# Altium schematic sheet Sheet_MAGJACK.SchDoc
size A4
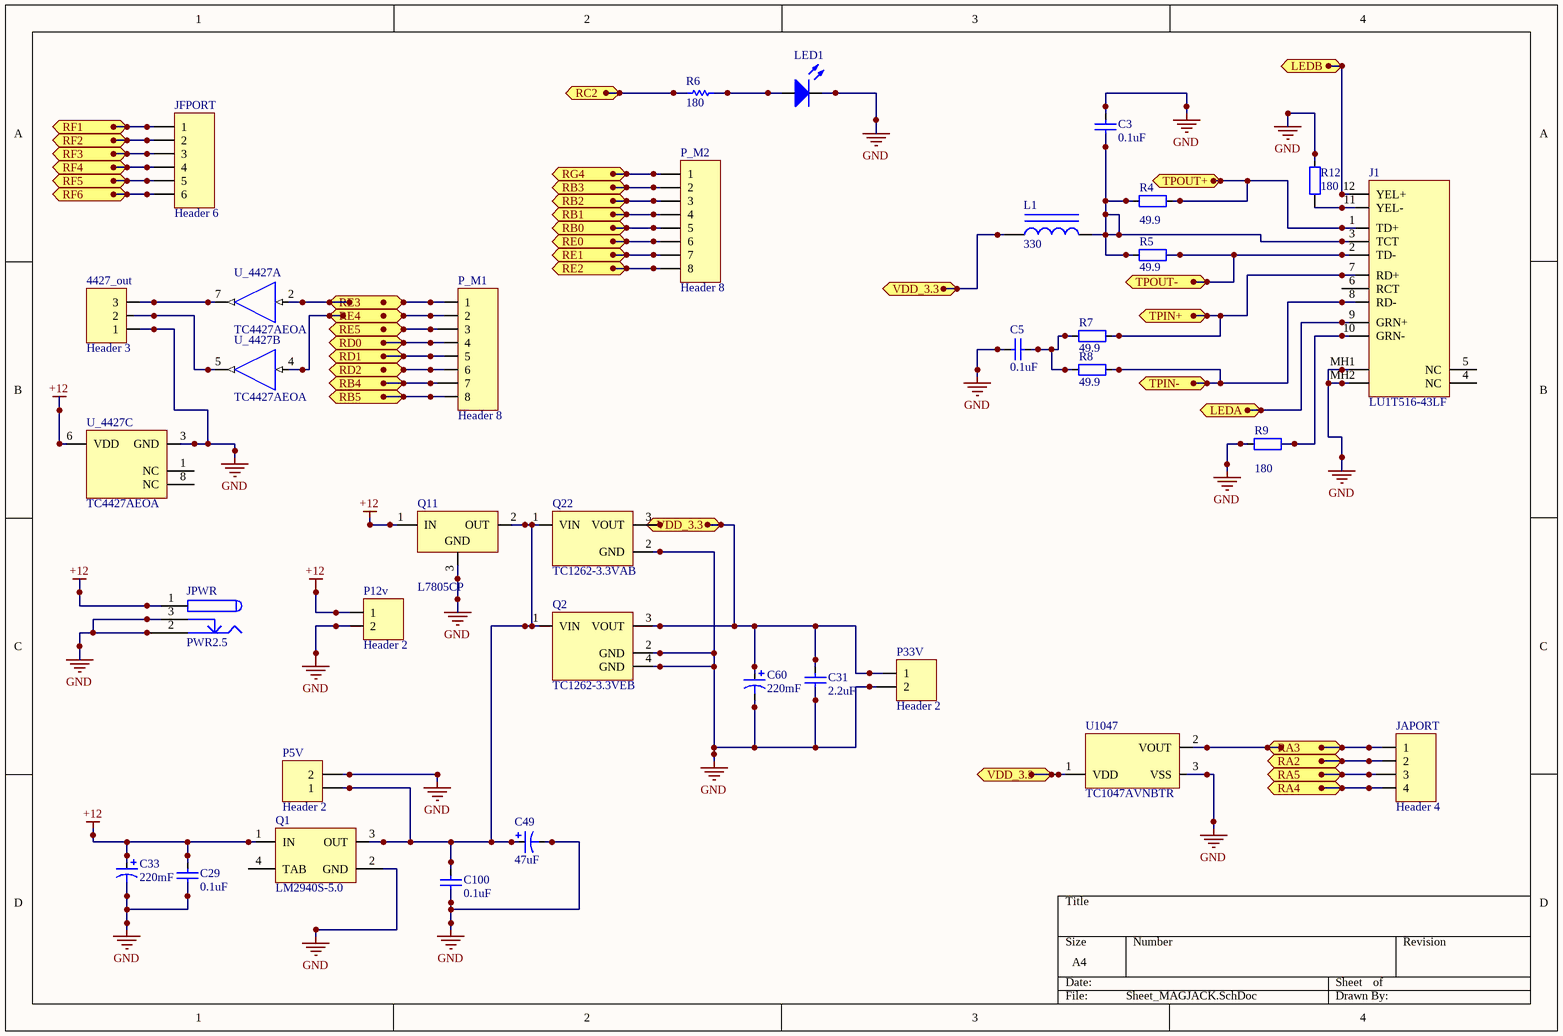
[diagram p0: Sheet_MAGJACK.SchDoc]

## Parts
4427_out  Header 3  [BIG4]
C3  0.1uF  [CAPC2012L]
C5  0.1uF  [CAPC2012L]
C29  0.1uF  [CAPC2012L]
C31  2.2uF  [CAPC3216L]
C33  220mF  [CAPPR5-10x12.5]
C49  47uF  [NSOALUMB]
C60  220mF  [CAPPR5-10x12.5]
C100  0.1uF  [CAPC2012L]
J1  LU1T516-43LF  [CON_RJ45_RA_LEDS]
JAPORT  Header 4  [HDR1X4]
JFPORT  Header 6  [HDR1X6]
JPWR  PWR2.5  [KLD-0202]
L1  330  [RESC2012L]
LED1  LED2  [CAPC2012L]  (value not drawn)
P5V  Header 2  [HDR1X2]
P12v  Header 2  [HDR1X2]
P33V  Header 2  [HDR1X2]
P_M1  Header 8  [HDR1X8]
P_M2  Header 8  [HDR1X8]
Q1  LM2940S-5.0  [TS3B_N]
Q2  TC1262-3.3VEB  [DDPAK-EB3_N]
Q11  L7805CP  [ISOWATT220AB]
Q22  TC1262-3.3VAB  [TO-220-AB3]
R4  49.9  [RESC2012L]
R5  49.9  [RESC2012L]
R6  180  [RESC2012L]
R7  49.9  [RESC2012L]
R8  49.9  [RESC2012L]
R9  180  [RESC2012L]
R12  180  [RESC2012L]
U1047  TC1047AVNBTR  [SOT-23-NB3_N]
U_4427  TC4427AEOA  [SOIC-OA8_N]  (parts A,B,C of 3)

## Ports
LEDA, LEDB, RA2, RA3, RA4, RA5, RB0, RB1, RB2, RB3, RB4, RB5, RC2, RD0, RD1, RD2, RE0, RE1, RE2, RE3, RE4, RE5, RF1, RF2, RF3, RF4, RF5, RF6, RG4, TPIN+, TPIN-, TPOUT+, TPOUT-, VDD_3.3

## Nets
+12: C29.2 C33.1 JPWR.1 JPWR.1A JPWR.1B P12v.1 Q1.1(IN) Q11.1(IN) U_4427.6(VDD)
GND: 4427_out.1 C3.2 C5.1 C29.1 C31.1 C33.2 C49.2 C60.2 C100.1 J1.MH1 J1.MH2 JPWR.2 JPWR.2A JPWR.2B JPWR.3 JPWR.3A JPWR.3B LED1.2(K) P5V.2 P12v.2 P33V.2 Q1.2(GND) Q2.2(GND) Q2.4(GND) Q11.3(GND) Q22.2(GND) R9.1 R12.2 U1047.3(VSS) U_4427.3(GND)
LEDA: J1.9(GRN+) ; port LEDA
LEDB: J1.12(YEL+) ; port LEDB
RA2: JAPORT.2 ; port RA2
RA3: JAPORT.1 U1047.2(VOUT) ; port RA3
RA4: JAPORT.4 ; port RA4
RA5: JAPORT.3 ; port RA5
RB0: P_M2.5 ; port RB0
RB1: P_M2.4 ; port RB1
RB2: P_M2.3 ; port RB2
RB3: P_M2.2 ; port RB3
RB4: P_M1.7 ; port RB4
RB5: P_M1.8 ; port RB5
RC2: R6.1 ; port RC2
RD0: P_M1.4 ; port RD0
RD1: P_M1.5 ; port RD1
RD2: P_M1.6 ; port RD2
RE0: P_M2.6 ; port RE0
RE1: P_M2.7 ; port RE1
RE2: P_M2.8 ; port RE2
RE3: P_M1.1 U_4427.2(INA) ; port RE3
RE4: P_M1.2 U_4427.4(INB) ; port RE4
RE5: P_M1.3 ; port RE5
RF1: JFPORT.1 ; port RF1
RF2: JFPORT.2 ; port RF2
RF3: JFPORT.3 ; port RF3
RF4: JFPORT.4 ; port RF4
RF5: JFPORT.5 ; port RF5
RF6: JFPORT.6 ; port RF6
RG4: P_M2.1 ; port RG4
TPIN+: J1.7(RD+) R7.2 ; port TPIN+
TPIN-: J1.8(RD-) R8.2 ; port TPIN-
TPOUT+: J1.1(TD+) R4.2 ; port TPOUT+
TPOUT-: J1.2(TD-) R5.2 ; port TPOUT-
VDD_3.3: C31.2 C60.1 L1.1 P33V.1 Q2.3(VOUT) U1047.1(VDD) ; port VDD_3.3
Net4427_out_2: 4427_out.2 U_4427.5(OUTB)
Net4427_out_3: 4427_out.3 U_4427.7(OUTA)
NetC3_1: C3.1 J1.3(TCT) L1.2 R4.1 R5.1
NetC5_2: C5.2 R7.1 R8.1
NetC49_1: C49.1 C100.2 P5V.1 Q1.3(OUT) Q2.1(VIN) Q11.2(OUT) Q22.1(VIN)
NetJ1_10: J1.10(GRN-) R9.2
NetJ1_11: J1.11(YEL-) R12.1
NetLED1_1: LED1.1(A) R6.2

Not connected (* = marked no-connect by the designer): J1 4(NC) 5(NC) 6(RCT); Q1 4(TAB); Q22 3(VOUT); U_4427 1(NC) 8(NC)

## Library data of the parts
4427_out = Header 3: Header, 3-Pin; LatestRevisionDate: 17-Jul-2002; LatestRevisionNote: Re-released for DXP Platform.; Publisher: Altium Limited
C3 C5 C29 C31 = Cap: Capacitor; Published: 8-Jun-2000; LatestRevisionDate: 17-Jul-2002; LatestRevisionNote: Re-released for DXP Platform.; PackageReference: RAD-0.3; Publisher: Altium Limited
  C3 C5 C29: Value: 0.1uF
  C31: Value: 2.2uF
C33 C49 C60 = Cap Pol1: Polarized Capacitor (Radial); Published: 8-Jun-2000; LatestRevisionDate: 17-Jul-2002; LatestRevisionNote: Re-released for DXP Platform.; PackageReference: RB7.6-15; Publisher: Altium Limited
  C33 C60: Value: 220mF
  C49: Value: 47uF
C100 = Cap Semi: Capacitor (Semiconductor SIM Model); Published: 8-Jun-2000; LatestRevisionDate: 29-May-2009; LatestRevisionNote: IPC-7351 Footprint Added.; PackageReference: C1206; Publisher: Altium Limited; PackageDescription: Chip Capacitor; Value: 0.1uF
J1 = Component_1
JAPORT = Header 4: Header, 4-Pin; LatestRevisionDate: 17-Jul-2002; LatestRevisionNote: Re-released for DXP Platform.; Publisher: Altium Limited
JFPORT = Header 6: Header, 6-Pin; LatestRevisionDate: 17-Jul-2002; LatestRevisionNote: Re-released for DXP Platform.; Publisher: Altium Limited
JPWR = PWR2.5: DC Power Jack, 2.5mm, KLD Series, PCB Mount; Published: 5-Jan-2004; DatasheetDocument: 09-May-2002; Publisher: Altium Limited
L1 = Inductor Iron: Magnetic-Core Inductor; Published: 24-Mar-1999; LatestRevisionDate: 17-Jul-2002; LatestRevisionNote: Re-released for DXP Platform.; PackageReference: AXIAL-0.9; Publisher: Altium Limited; Value: 330
LED1 = LED2: Typical RED, GREEN, YELLOW, AMBER GaAs LED; Published: 8-Jun-2000; LatestRevisionDate: 17-Jul-2002; LatestRevisionNote: Re-released for DXP Platform.; PackageReference: 3.2X1.6X1.1; Publisher: Altium Limited; PackageVersion: Feb-2002
P5V P12v P33V = Header 2: Header, 2-Pin; LatestRevisionDate: 17-Jul-2002; LatestRevisionNote: Re-released for DXP Platform.; Publisher: Altium Limited
P_M1 P_M2 = Header 8: Header, 8-Pin; LatestRevisionDate: 17-Jul-2002; LatestRevisionNote: Re-released for DXP Platform.; Publisher: Altium Limited
Q1 = LM2940S-5.0: 1A Low Dropout Regulator; Manufacturer: National Semiconductor; CompType: LDO IC; PackageTopMarking: NSUZXYTTE#*LM2940S*-5.0 P+; PowerWise: N; Published: 4-Dec-2008; DatasheetVersion: Jan-2007; PackageVersion: revF, Apr-2005; PackageReference: TS3B; Publisher: Altium Limited; PackageDescription: TO-263, Molded, .400 x .390 x .180in, 3 Lead, .1in Pitch, Surface Mount; PartNumber: LM2940S-5.0; RoHS: O; PinCount: 3; DigiKeyPartNumber: LM2940S-5.0-ND; Code_JEDEC: MO-169-AA; ComponentLink1Description: LM2940 Datasheet; ComponentLink1URL: http://www.national.com/ds/LM/LM2940.pdf; ComponentLink2Description: LM2940 Web Page; ComponentLink2URL: http://www.national.com/pf/LM/LM2940.html; ComponentLink3Description: TS3B Package Page; ComponentLink3URL: http://www.national.com/packaging/folders/ts3b.html
Q2 = TC1262-3.3VEB: 500mA Fixed Output CMOS LDO, 3-Pin DDPAK, Extended Temperature; FirstPublished: 29-Jan-2009; DatasheetVersion: revB, 2002; PackageVersion: revBB, Aug-2009; PackageReference: DDPAK-EB3; Publisher: Altium Limited; PackageDescription: 3-Lead Plastic (EB) [DDPAK]; ComponentLink1Description: Datasheet; ComponentLink1URL: http://ww1.microchip.com/downloads/en/DeviceDoc/21373b.pdf; ComponentLink2Description: Packaging Specification; ComponentLink2URL: http://www.microchip.com/stellent/groups/techpub_sg/documents/packagingspec/en012702.pdf; ComponentLink3Description: Microchip.com Home; ComponentLink3URL: http://www.microchip.com/
Q11 = L7805CP: Positive Voltage Regulator; Note: Tab is connected to pin 3 (GND).; Published: 24-Aug-2001; LatestRevisionDate: 17-Jul-2002; LatestRevisionNote: Re-released for DXP Platform.; DatasheetVersion: Dec-1998; PackageVersion: Jul-1998; PackageReference: ISOWATT220AB; Publisher: Altium Limited; PackageDescription: TO, Thru-Hole, Vertical, Heatsink Mounted; 3 In-Line Leads; Pitch 2.54 mm; Pin sequence 1, 3, 2; ComponentLink1Description: Manufacturer Link; ComponentLink1URL: http://www.st.com/
Q22 = TC1262-3.3VAB: 500mA Fixed Output CMOS LDO, 3-Pin TO-220, Extended Temperature; FirstPublished: 29-Jan-2009; DatasheetVersion: revB, 2002; PackageVersion: revBB, Aug-2009; PackageReference: TO-220-AB3; Publisher: Altium Limited; PackageDescription: 3-Lead Plastic Transistor Outline (AB) [TO-220]; Supplier 1: Digi-Key; Supplier Part Number 1: TC1262-3.3VAB-ND; Supplier 2: Newark; Supplier Part Number 2: 92C5755; ComponentLink1Description: Datasheet; ComponentLink1URL: http://ww1.microchip.com/downloads/en/DeviceDoc/21373b.pdf; ComponentLink2Description: Packaging Specification; ComponentLink2URL: http://www.microchip.com/stellent/groups/techpub_sg/documents/packagingspec/en012702.pdf; ComponentLink3Description: Microchip.com Home; ComponentLink3URL: http://www.microchip.com/
R4 R5 R7-R9 R12 = Res2: Resistor; Published: 8-Jun-2000; LatestRevisionDate: 17-Jul-2002; LatestRevisionNote: Re-released for DXP Platform.; PackageReference: AXIAL-0.4; Publisher: Altium Limited
  R4 R5 R7 R8: Value: 49.9
  R9 R12: Value: 180
R6 = Res Semi: Semiconductor Resistor; Published: 8-Jun-2000; LatestRevisionDate: 17-Jul-2002; LatestRevisionNote: Re-released for DXP Platform.; PackageReference: AXIAL-0.5; Publisher: Altium Limited; Value: 180
U1047 = TC1047AVNBTR: Precision Temperature-to-Voltage Converter, 3-Pin SOT-23, Extended Temperature, Tape and Reel; FirstPublished: 29-Jan-2009; DatasheetVersion: revC, May-2005; PackageVersion: revBB, Aug-2009; PackageReference: SOT-23-NB3; Publisher: Altium Limited; PackageDescription: 3-Lead Plastic Small Outline Transistor (NB) [SOT-23]; Supplier 1: Digi-Key; Supplier Part Number 1: TC1047AVNBTR-ND; Supplier 2: Digi-Key; Supplier Part Number 2: TC1047AVNBCT-ND; Supplier 3: Digi-Key; Supplier Part Number 3: TC1047AVNBDKR-ND; Supplier 4: Farnell; Supplier Part Number 4: 9762531; Supplier 5: Newark; Supplier Part Number 5: 89C8093; Code_IPC: SOT23-3; ComponentLink1Description: Datasheet; ComponentLink1URL: http://ww1.microchip.com/downloads/en/DeviceDoc/21498C.pdf; ComponentLink2Description: Packaging Specification; ComponentLink2URL: http://www.microchip.com/stellent/groups/techpub_sg/documents/packagingspec/en012702.pdf; ComponentLink3Description: Microchip.com Home; ComponentLink3URL: http://www.microchip.com/
U_4427 = TC4427AEOA: 1.5A Dual High-Speed Power MOSFET Driver, Non-Inverting, Industrial Temperature; FirstPublished: 29-Jan-2009; DatasheetVersion: revF, Jan-2006; PackageVersion: revBB, Aug-2009; PackageReference: SOIC-OA8; Publisher: Altium Limited; PackageDescription: 8-Lead Plastic Small Outline (OA) - Narrow, 3.90mm Body [SOIC]; Supplier 1: Digi-Key; Supplier Part Number 1: TC4427AEOA-ND; Supplier 2: Farnell; Supplier Part Number 2: 1292285; Supplier 3: Newark; Supplier Part Number 3: 96K4020; Code_IPC: SOIC127P600-8; ComponentLink1Description: Datasheet; ComponentLink1URL: http://ww1.microchip.com/downloads/en/DeviceDoc/21423F.pdf; ComponentLink2Description: Packaging Specification; ComponentLink2URL: http://www.microchip.com/stellent/groups/techpub_sg/documents/packagingspec/en012702.pdf; ComponentLink3Description: Microchip.com Home; ComponentLink3URL: http://www.microchip.com/